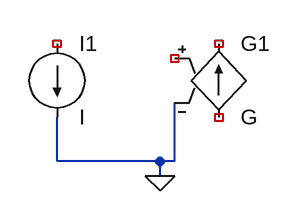
[diagram p0: schematic 14 - Skin Bug.asc]
14 - Skin Bug.asc, the LTspice schematic file:
Version 4.1
SHEET 1 880 680
WIRE -560 528 -560 480
WIRE -448 528 -560 528
WIRE -432 528 -432 464
WIRE -432 528 -448 528
WIRE -448 544 -448 528
FLAG -448 544 0
SYMBOL current -560 400 R0
SYMATTR InstName I1
SYMBOL g -384 384 R0
SYMATTR InstName G1

The netlist it stands for:
* 14 - Skin Bug.asc
I1 NC_01 0 I
G1 NC_02 NC_03 NC_04 0 G
.backanno
.end